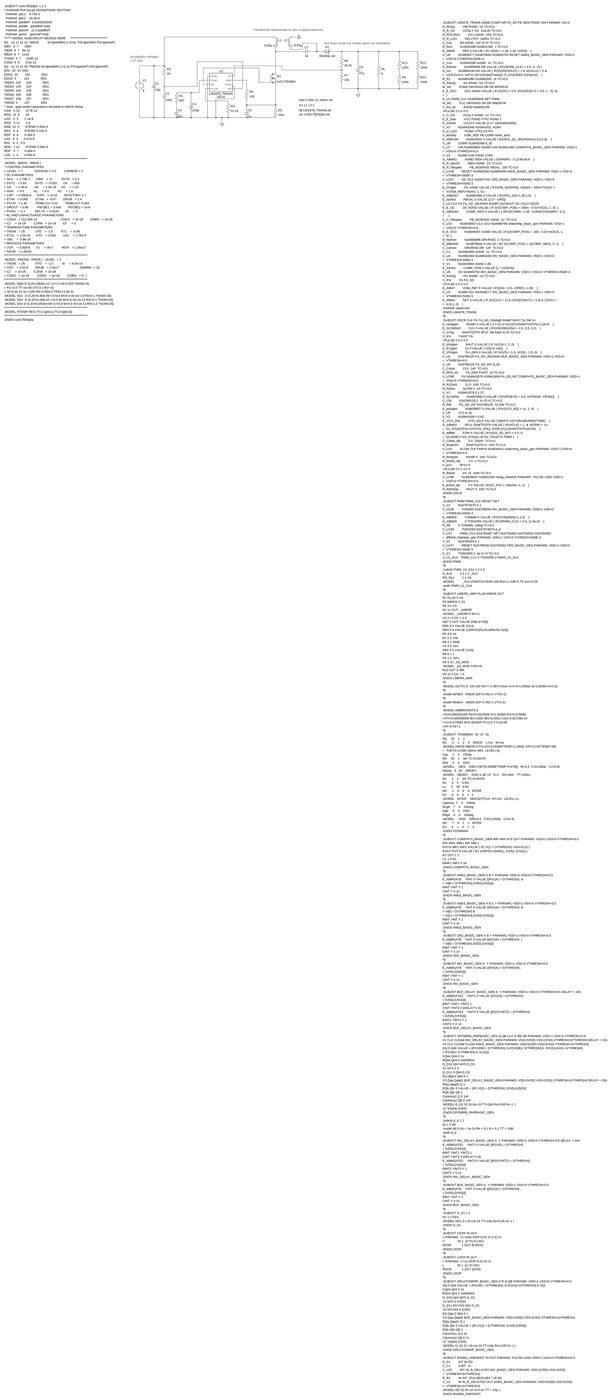
[diagram p0: schematic SolarCharge.asc, whole sheet]
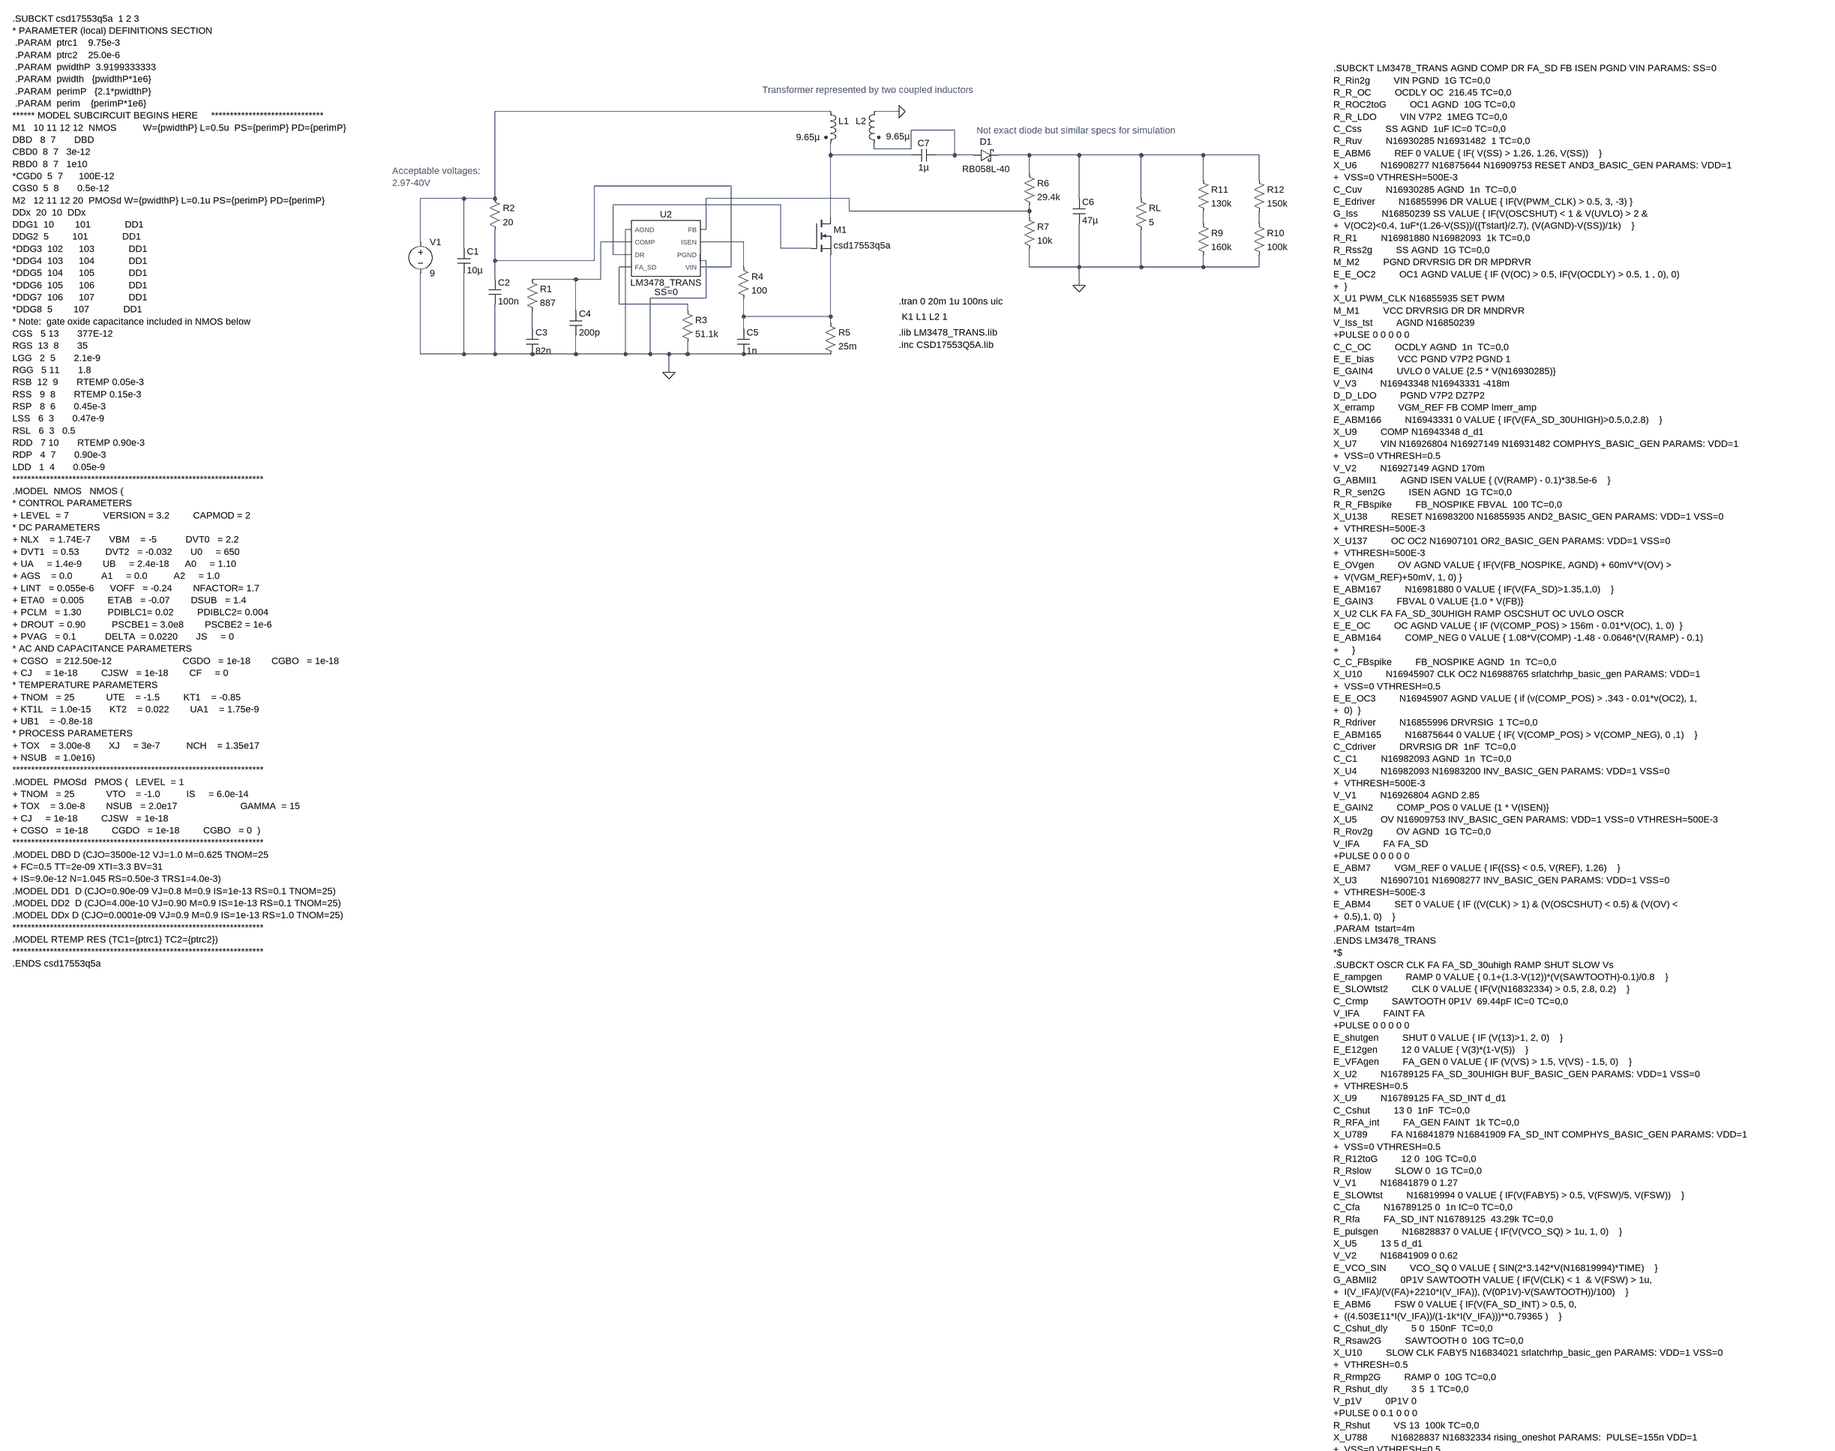
[diagram p1: schematic SolarCharge.asc, part, row 1 of 3, column 1 of 1]
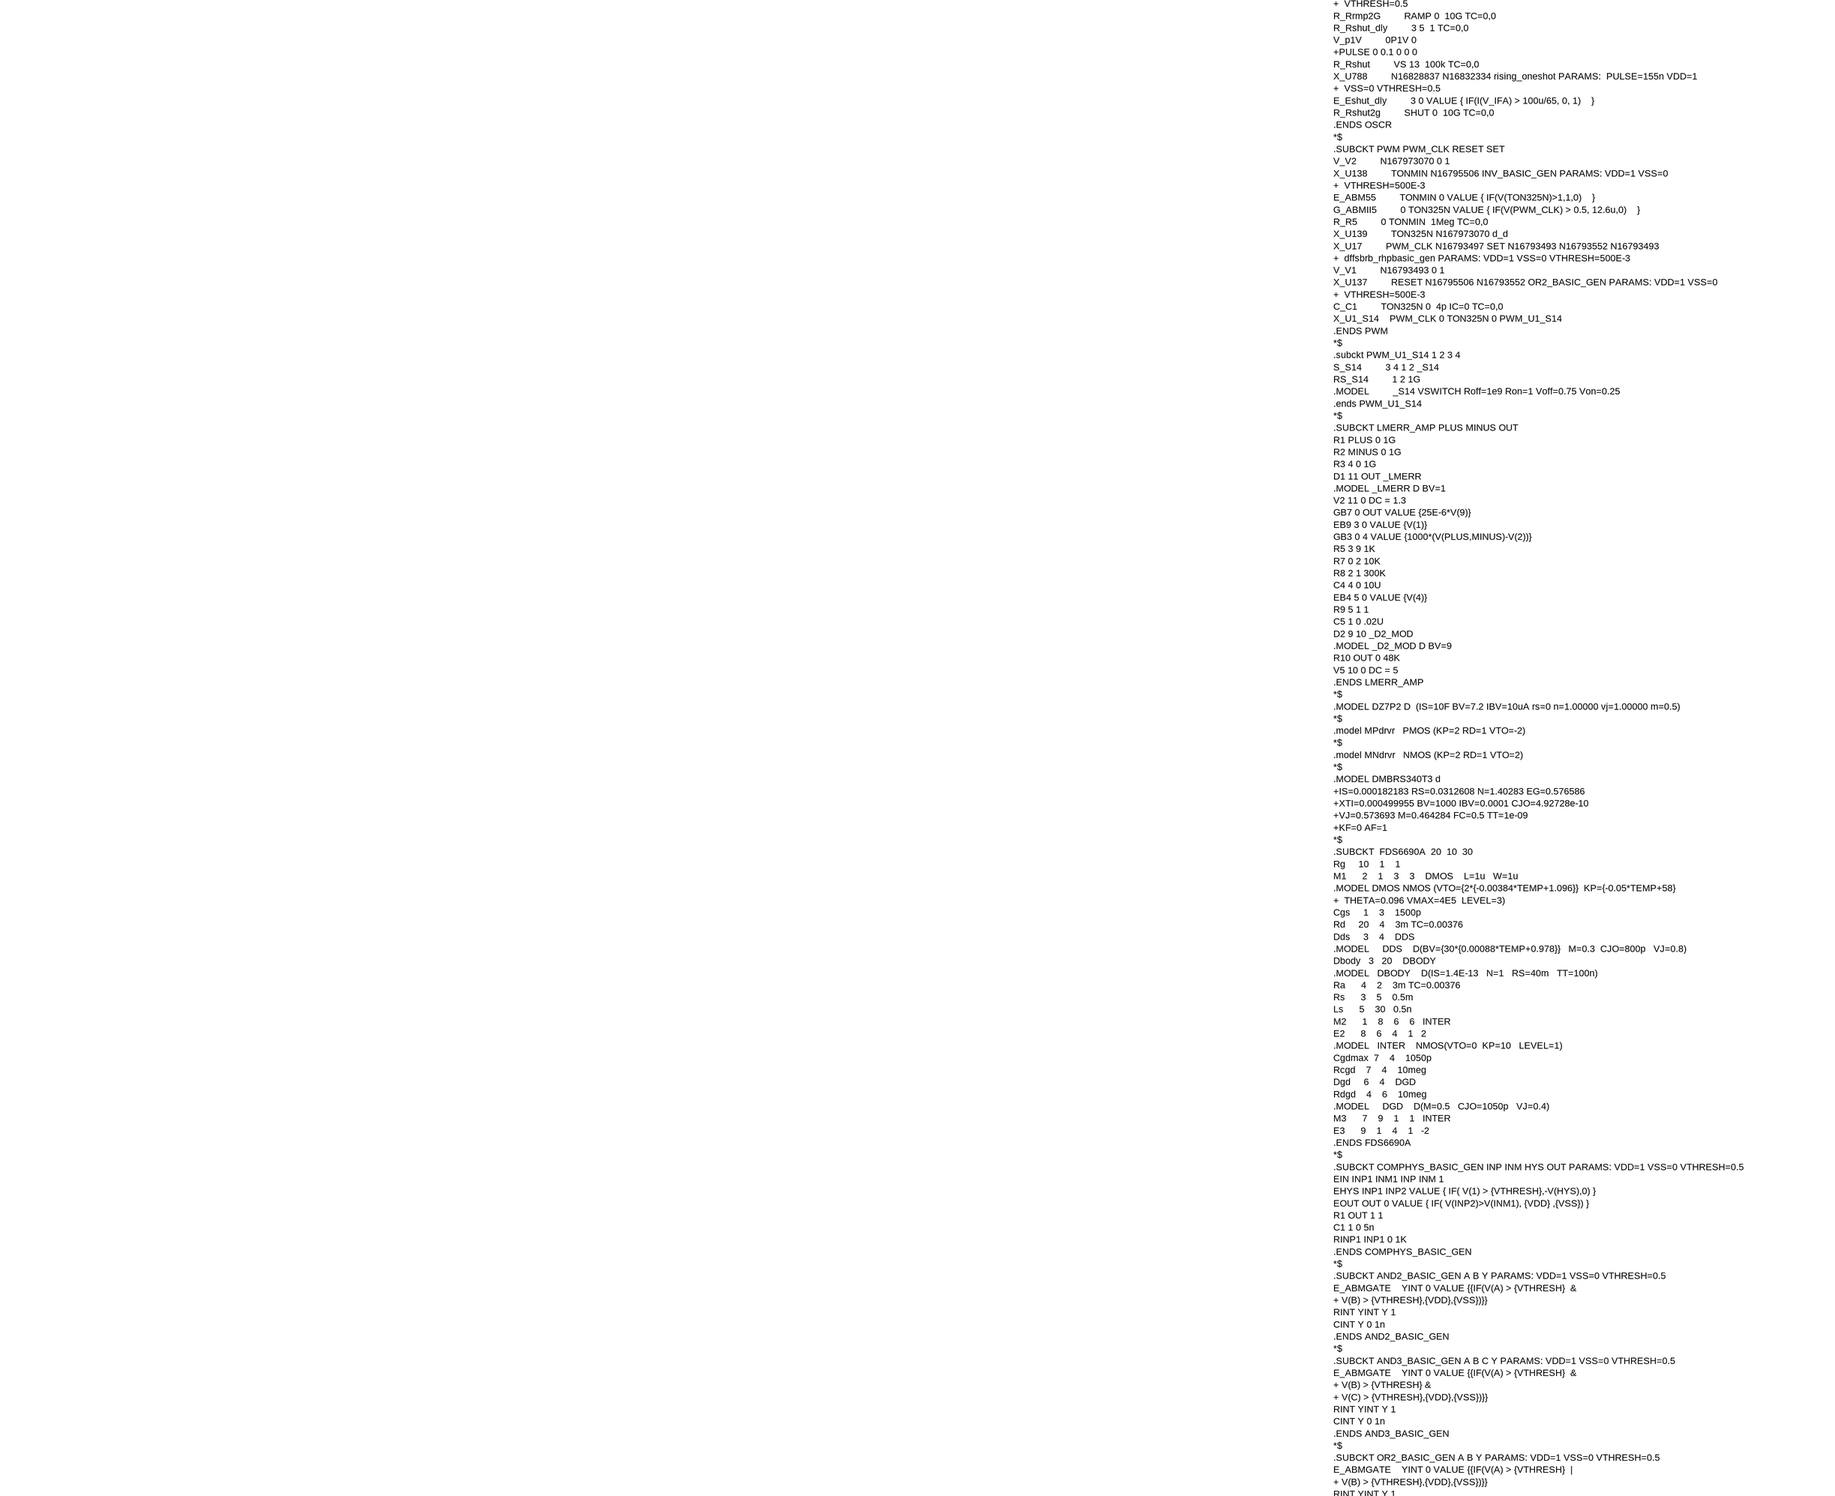
[diagram p2: schematic SolarCharge.asc, part, row 2 of 3, column 1 of 1]
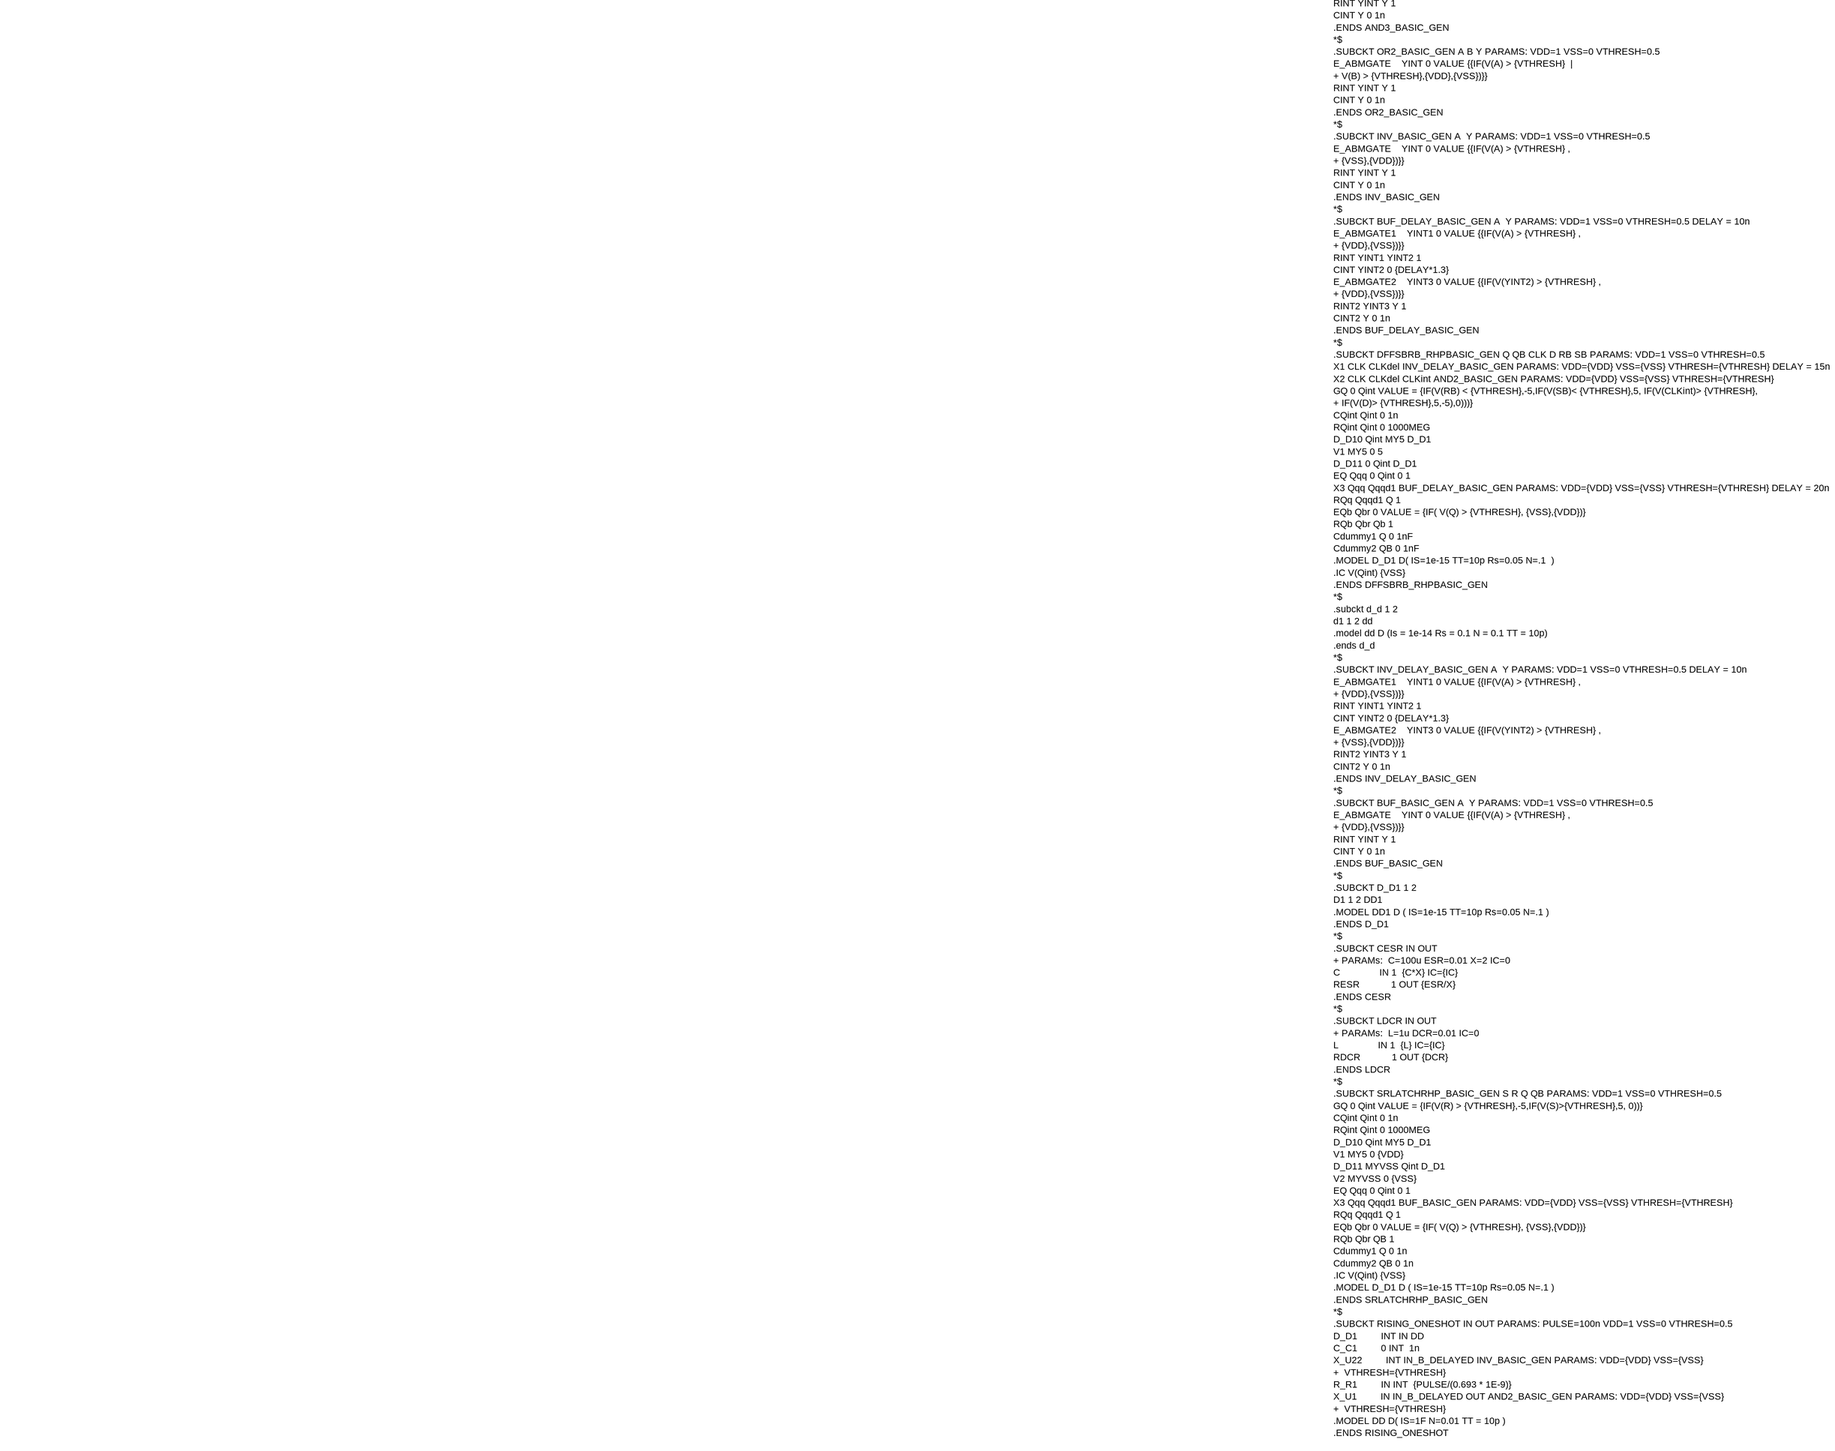
[diagram p3: schematic SolarCharge.asc, part, row 3 of 3, column 1 of 1]
SolarCharge.asc, the LTspice schematic file:
Version 4
SHEET 1 3908 10964
WIRE 1120 -176 256 -176
WIRE 1296 -176 1232 -176
WIRE 1440 -128 1328 -128
WIRE 1232 -80 1232 -96
WIRE 1328 -80 1328 -128
WIRE 1328 -80 1232 -80
WIRE 1120 -64 1120 -96
WIRE 1328 -64 1120 -64
WIRE 1440 -64 1440 -128
WIRE 1440 -64 1392 -64
WIRE 1488 -64 1440 -64
WIRE 1632 -64 1552 -64
WIRE 1760 -64 1632 -64
WIRE 1920 -64 1760 -64
WIRE 2080 -64 1920 -64
WIRE 2224 -64 2080 -64
WIRE 1632 -16 1632 -64
WIRE 2080 0 2080 -64
WIRE 2224 0 2224 -64
WIRE 864 16 512 16
WIRE 176 48 64 48
WIRE 256 48 256 -176
WIRE 256 48 176 48
WIRE 1168 48 800 48
WIRE 1760 48 1760 -64
WIRE 1920 48 1920 -64
WIRE 992 64 560 64
WIRE 1168 80 1168 48
WIRE 1632 80 1632 64
WIRE 1632 80 1168 80
WIRE 1120 96 1120 -64
WIRE 1632 96 1632 80
WIRE 2080 112 2080 80
WIRE 2224 112 2224 80
WIRE 608 128 592 128
WIRE 800 128 800 48
WIRE 800 128 784 128
WIRE 64 160 64 48
WIRE 608 160 528 160
WIRE 896 160 784 160
WIRE 176 176 176 48
WIRE 992 176 992 64
WIRE 1072 176 992 176
WIRE 560 192 560 64
WIRE 608 192 560 192
WIRE 256 208 256 128
WIRE 512 208 512 16
WIRE 512 208 256 208
WIRE 784 208 784 192
WIRE 800 208 784 208
WIRE 608 224 576 224
WIRE 864 224 864 16
WIRE 864 224 784 224
WIRE 896 224 896 160
WIRE 1632 224 1632 176
WIRE 1760 224 1760 112
WIRE 1760 224 1632 224
WIRE 1920 224 1920 128
WIRE 1920 224 1760 224
WIRE 2080 224 2080 192
WIRE 2080 224 1920 224
WIRE 2224 224 2224 192
WIRE 2224 224 2080 224
WIRE 256 256 256 208
WIRE 464 256 352 256
WIRE 528 256 528 160
WIRE 528 256 464 256
WIRE 1760 272 1760 224
WIRE 800 304 800 208
WIRE 800 304 656 304
WIRE 576 320 576 224
WIRE 752 320 576 320
WIRE 464 336 464 256
WIRE 752 336 752 320
WIRE 896 352 896 304
WIRE 1120 352 1120 192
WIRE 1120 352 896 352
WIRE 1120 368 1120 352
WIRE 352 384 352 336
WIRE 896 384 896 352
WIRE 64 448 64 240
WIRE 176 448 176 240
WIRE 176 448 64 448
WIRE 256 448 256 320
WIRE 256 448 176 448
WIRE 352 448 256 448
WIRE 464 448 464 400
WIRE 464 448 352 448
WIRE 592 448 592 128
WIRE 592 448 464 448
WIRE 656 448 656 304
WIRE 656 448 592 448
WIRE 704 448 656 448
WIRE 752 448 752 416
WIRE 752 448 704 448
WIRE 896 448 752 448
WIRE 1120 448 896 448
WIRE 704 496 704 448
FLAG 1296 -176 0
FLAG 704 496 0
FLAG 1760 272 0
SYMBOL voltage 64 144 R0
WINDOW 123 0 0 Left 0
WINDOW 39 0 0 Left 0
SYMATTR InstName V1
SYMATTR Value 9
SYMBOL cap 160 176 R0
SYMATTR InstName C1
SYMATTR Value 10µ
SYMATTR SpiceLine V=16
SYMBOL cap 336 384 R0
SYMATTR InstName C3
SYMATTR Value 82n
SYMBOL res 336 240 R0
SYMATTR InstName R1
SYMATTR Value 887
SYMBOL res 240 32 R0
SYMATTR InstName R2
SYMATTR Value 20
SYMBOL cap 448 336 R0
SYMATTR InstName C4
SYMATTR Value 200p
SYMBOL res 736 320 R0
SYMATTR InstName R3
SYMATTR Value 51.1k
SYMBOL res 880 208 R0
SYMATTR InstName R4
SYMATTR Value 100
SYMBOL cap 880 384 R0
SYMATTR InstName C5
SYMATTR Value 1n
SYMBOL nmos 1072 96 R0
SYMATTR InstName M1
SYMATTR Value csd17553q5a
SYMATTR Prefix X
SYMBOL res 1104 352 R0
SYMATTR InstName R5
SYMATTR Value 25m
SYMBOL ind2 1104 -192 R0
WINDOW 3 -73 81 Left 2
SYMATTR Value 9.65µ
SYMATTR InstName L1
SYMBOL cap 1392 -80 R90
WINDOW 0 0 32 VBottom 2
WINDOW 3 32 32 VTop 2
SYMATTR InstName C7
SYMATTR Value 1µ
SYMBOL ind2 1248 -192 M0
WINDOW 3 -76 79 Left 2
SYMATTR Value 9.65µ
SYMATTR InstName L2
SYMBOL schottky 1488 -48 R270
WINDOW 0 36 32 VTop 2
WINDOW 3 -4 32 VBottom 2
SYMATTR InstName D1
SYMATTR Value RB058L-40
SYMATTR Description Zener Diode
SYMATTR Type zener
SYMBOL res 1616 -32 R0
SYMATTR InstName R6
SYMATTR Value 29.4k
SYMBOL res 1616 80 R0
SYMATTR InstName R7
SYMATTR Value 10k
SYMBOL cap 1744 48 R0
SYMATTR InstName C6
SYMATTR Value 47µ
SYMBOL res 1904 32 R0
SYMATTR InstName RL
SYMATTR Value 5
SYMBOL cap 240 256 R0
SYMATTR InstName C2
SYMATTR Value 100n
SYMBOL LM3478_TRANS 688 176 R0
SYMATTR InstName U2
SYMBOL res 2064 96 R0
SYMATTR InstName R9
SYMATTR Value 160k
SYMBOL res 2208 96 R0
SYMATTR InstName R10
SYMATTR Value 100k
SYMBOL res 2064 -16 R0
SYMATTR InstName R11
SYMATTR Value 130k
SYMBOL res 2208 -16 R0
SYMATTR InstName R12
SYMATTR Value 150k
TEXT 1304 352 Left 2 !K1 L1 L2 1
TEXT 1296 312 Left 2 !.tran 0 20m 1u 100ns uic
TEXT 2600 -288 Left 2 !.SUBCKT LM3478_TRANS AGND COMP DR FA_SD FB ISEN PGND VIN PARAMS: SS=0\nR_Rin2g         VIN PGND  1G TC=0,0\nR_R_OC         OCDLY OC  216.45 TC=0,0\nR_ROC2toG         OC1 AGND  10G TC=0,0\nR_R_LDO         VIN V7P2  1MEG TC=0,0\nC_Css         SS AGND  1uF IC=0 TC=0,0\nR_Ruv         N16930285 N16931482  1 TC=0,0\nE_ABM6         REF 0 VALUE { IF( V(SS) > 1.26, 1.26, V(SS))    }\nX_U6         N16908277 N16875644 N16909753 RESET AND3_BASIC_GEN PARAMS: VDD=1\n+  VSS=0 VTHRESH=500E-3\nC_Cuv         N16930285 AGND  1n  TC=0,0\nE_Edriver         N16855996 DR VALUE { IF(V(PWM_CLK) > 0.5, 3, -3) }\nG_Iss         N16850239 SS VALUE { IF(V(OSCSHUT) < 1 & V(UVLO) > 2 &\n+  V(OC2)<0.4, 1uF*(1.26-V(SS))/({Tstart}/2.7), (V(AGND)-V(SS))/1k)    }\nR_R1         N16981880 N16982093  1k TC=0,0\nR_Rss2g         SS AGND  1G TC=0,0\nM_M2         PGND DRVRSIG DR DR MPDRVR\nE_E_OC2         OC1 AGND VALUE { IF (V(OC) > 0.5, IF(V(OCDLY) > 0.5, 1 , 0), 0)\n+  }\nX_U1 PWM_CLK N16855935 SET PWM\nM_M1         VCC DRVRSIG DR DR MNDRVR\nV_Iss_tst         AGND N16850239\n+PULSE 0 0 0 0 0\nC_C_OC         OCDLY AGND  1n  TC=0,0\nE_E_bias         VCC PGND V7P2 PGND 1\nE_GAIN4         UVLO 0 VALUE {2.5 * V(N16930285)}\nV_V3         N16943348 N16943331 -418m\nD_D_LDO         PGND V7P2 DZ7P2\nX_erramp         VGM_REF FB COMP lmerr_amp\nE_ABM166         N16943331 0 VALUE { IF(V(FA_SD_30UHIGH)>0.5,0,2.8)    }\nX_U9         COMP N16943348 d_d1\nX_U7         VIN N16926804 N16927149 N16931482 COMPHYS_BASIC_GEN PARAMS: VDD=1\n+  VSS=0 VTHRESH=0.5\nV_V2         N16927149 AGND 170m\nG_ABMII1         AGND ISEN VALUE { (V(RAMP) - 0.1)*38.5e-6    }\nR_R_sen2G         ISEN AGND  1G TC=0,0\nR_R_FBspike         FB_NOSPIKE FBVAL  100 TC=0,0\nX_U138         RESET N16983200 N16855935 AND2_BASIC_GEN PARAMS: VDD=1 VSS=0\n+  VTHRESH=500E-3\nX_U137         OC OC2 N16907101 OR2_BASIC_GEN PARAMS: VDD=1 VSS=0\n+  VTHRESH=500E-3\nE_OVgen         OV AGND VALUE { IF(V(FB_NOSPIKE, AGND) + 60mV*V(OV) >\n+  V(VGM_REF)+50mV, 1, 0) }\nE_ABM167         N16981880 0 VALUE { IF(V(FA_SD)>1.35,1,0)    }\nE_GAIN3         FBVAL 0 VALUE {1.0 * V(FB)}\nX_U2 CLK FA FA_SD_30UHIGH RAMP OSCSHUT OC UVLO OSCR\nE_E_OC         OC AGND VALUE { IF (V(COMP_POS) > 156m - 0.01*V(OC), 1, 0)  }\nE_ABM164         COMP_NEG 0 VALUE { 1.08*V(COMP) -1.48 - 0.0646*(V(RAMP) - 0.1)\n+     }\nC_C_FBspike         FB_NOSPIKE AGND  1n  TC=0,0\nX_U10         N16945907 CLK OC2 N16988765 srlatchrhp_basic_gen PARAMS: VDD=1\n+  VSS=0 VTHRESH=0.5\nE_E_OC3         N16945907 AGND VALUE { if (v(COMP_POS) > .343 - 0.01*v(OC2), 1,\n+  0)  }\nR_Rdriver         N16855996 DRVRSIG  1 TC=0,0\nE_ABM165         N16875644 0 VALUE { IF( V(COMP_POS) > V(COMP_NEG), 0 ,1)    }\nC_Cdriver         DRVRSIG DR  1nF  TC=0,0\nC_C1         N16982093 AGND  1n  TC=0,0\nX_U4         N16982093 N16983200 INV_BASIC_GEN PARAMS: VDD=1 VSS=0\n+  VTHRESH=500E-3\nV_V1         N16926804 AGND 2.85\nE_GAIN2         COMP_POS 0 VALUE {1 * V(ISEN)}\nX_U5         OV N16909753 INV_BASIC_GEN PARAMS: VDD=1 VSS=0 VTHRESH=500E-3\nR_Rov2g         OV AGND  1G TC=0,0\nV_IFA         FA FA_SD\n+PULSE 0 0 0 0 0\nE_ABM7         VGM_REF 0 VALUE { IF({SS} < 0.5, V(REF), 1.26)    }\nX_U3         N16907101 N16908277 INV_BASIC_GEN PARAMS: VDD=1 VSS=0\n+  VTHRESH=500E-3\nE_ABM4         SET 0 VALUE { IF ((V(CLK) > 1) & (V(OSCSHUT) < 0.5) & (V(OV) <\n+  0.5),1, 0)    }\n.PARAM  tstart=4m\n.ENDS LM3478_TRANS\n*$\n.SUBCKT OSCR CLK FA FA_SD_30uhigh RAMP SHUT SLOW Vs\nE_rampgen         RAMP 0 VALUE { 0.1+(1.3-V(12))*(V(SAWTOOTH)-0.1)/0.8    }\nE_SLOWtst2         CLK 0 VALUE { IF(V(N16832334) > 0.5, 2.8, 0.2)    }\nC_Crmp         SAWTOOTH 0P1V  69.44pF IC=0 TC=0,0\nV_IFA         FAINT FA\n+PULSE 0 0 0 0 0\nE_shutgen         SHUT 0 VALUE { IF (V(13)>1, 2, 0)    }\nE_E12gen         12 0 VALUE { V(3)*(1-V(5))    }\nE_VFAgen         FA_GEN 0 VALUE { IF (V(VS) > 1.5, V(VS) - 1.5, 0)    }\nX_U2         N16789125 FA_SD_30UHIGH BUF_BASIC_GEN PARAMS: VDD=1 VSS=0\n+  VTHRESH=0.5\nX_U9         N16789125 FA_SD_INT d_d1\nC_Cshut         13 0  1nF  TC=0,0\nR_RFA_int         FA_GEN FAINT  1k TC=0,0\nX_U789         FA N16841879 N16841909 FA_SD_INT COMPHYS_BASIC_GEN PARAMS: VDD=1\n+  VSS=0 VTHRESH=0.5\nR_R12toG         12 0  10G TC=0,0\nR_Rslow         SLOW 0  1G TC=0,0\nV_V1         N16841879 0 1.27\nE_SLOWtst         N16819994 0 VALUE { IF(V(FABY5) > 0.5, V(FSW)/5, V(FSW))    }\nC_Cfa         N16789125 0  1n IC=0 TC=0,0\nR_Rfa         FA_SD_INT N16789125  43.29k TC=0,0\nE_pulsgen         N16828837 0 VALUE { IF(V(VCO_SQ) > 1u, 1, 0)    }\nX_U5         13 5 d_d1\nV_V2         N16841909 0 0.62\nE_VCO_SIN         VCO_SQ 0 VALUE { SIN(2*3.142*V(N16819994)*TIME)    }\nG_ABMII2         0P1V SAWTOOTH VALUE { IF(V(CLK) < 1  & V(FSW) > 1u,\n+  I(V_IFA)/(V(FA)+2210*I(V_IFA)), (V(0P1V)-V(SAWTOOTH))/100)    }\nE_ABM6         FSW 0 VALUE { IF(V(FA_SD_INT) > 0.5, 0,\n+  ((4.503E11*I(V_IFA))/(1-1k*I(V_IFA)))**0.79365 )    }\nC_Cshut_dly         5 0  150nF  TC=0,0\nR_Rsaw2G         SAWTOOTH 0  10G TC=0,0\nX_U10         SLOW CLK FABY5 N16834021 srlatchrhp_basic_gen PARAMS: VDD=1 VSS=0\n+  VTHRESH=0.5\nR_Rrmp2G         RAMP 0  10G TC=0,0\nR_Rshut_dly         3 5  1 TC=0,0\nV_p1V         0P1V 0\n+PULSE 0 0.1 0 0 0\nR_Rshut         VS 13  100k TC=0,0\nX_U788         N16828837 N16832334 rising_oneshot PARAMS:  PULSE=155n VDD=1\n+  VSS=0 VTHRESH=0.5\nE_Eshut_dly         3 0 VALUE { IF(I(V_IFA) > 100u/65, 0, 1)    }\nR_Rshut2g         SHUT 0  10G TC=0,0\n.ENDS OSCR\n*$\n.SUBCKT PWM PWM_CLK RESET SET\nV_V2         N167973070 0 1\nX_U138         TONMIN N16795506 INV_BASIC_GEN PARAMS: VDD=1 VSS=0\n+  VTHRESH=500E-3\nE_ABM55         TONMIN 0 VALUE { IF(V(TON325N)>1,1,0)    }\nG_ABMII5         0 TON325N VALUE { IF(V(PWM_CLK) > 0.5, 12.6u,0)    }\nR_R5         0 TONMIN  1Meg TC=0,0\nX_U139         TON325N N167973070 d_d\nX_U17         PWM_CLK N16793497 SET N16793493 N16793552 N16793493\n+  dffsbrb_rhpbasic_gen PARAMS: VDD=1 VSS=0 VTHRESH=500E-3\nV_V1         N16793493 0 1\nX_U137         RESET N16795506 N16793552 OR2_BASIC_GEN PARAMS: VDD=1 VSS=0\n+  VTHRESH=500E-3\nC_C1         TON325N 0  4p IC=0 TC=0,0\nX_U1_S14    PWM_CLK 0 TON325N 0 PWM_U1_S14\n.ENDS PWM\n*$\n.subckt PWM_U1_S14 1 2 3 4\nS_S14         3 4 1 2 _S14\nRS_S14         1 2 1G\n.MODEL         _S14 VSWITCH Roff=1e9 Ron=1 Voff=0.75 Von=0.25\n.ends PWM_U1_S14\n*$\n.SUBCKT LMERR_AMP PLUS MINUS OUT\nR1 PLUS 0 1G\nR2 MINUS 0 1G\nR3 4 0 1G\nD1 11 OUT _LMERR\n.MODEL _LMERR D BV=1\nV2 11 0 DC = 1.3\nGB7 0 OUT VALUE {25E-6*V(9)}\nEB9 3 0 VALUE {V(1)}\nGB3 0 4 VALUE {1000*(V(PLUS,MINUS)-V(2))}\nR5 3 9 1K\nR7 0 2 10K\nR8 2 1 300K\nC4 4 0 10U\nEB4 5 0 VALUE {V(4)}\nR9 5 1 1\nC5 1 0 .02U\nD2 9 10 _D2_MOD\n.MODEL _D2_MOD D BV=9\nR10 OUT 0 48K\nV5 10 0 DC = 5\n.ENDS LMERR_AMP\n*$\n.MODEL DZ7P2 D  (IS=10F BV=7.2 IBV=10uA rs=0 n=1.00000 vj=1.00000 m=0.5)\n*$\n.model MPdrvr   PMOS (KP=2 RD=1 VTO=-2)\n*$\n.model MNdrvr   NMOS (KP=2 RD=1 VTO=2)\n*$\n.MODEL DMBRS340T3 d\n+IS=0.000182183 RS=0.0312608 N=1.40283 EG=0.576586\n+XTI=0.000499955 BV=1000 IBV=0.0001 CJO=4.92728e-10\n+VJ=0.573693 M=0.464284 FC=0.5 TT=1e-09\n+KF=0 AF=1\n*$\n.SUBCKT  FDS6690A  20  10  30\nRg     10    1    1\nM1      2    1    3    3    DMOS    L=1u   W=1u\n.MODEL DMOS NMOS (VTO={2*{-0.00384*TEMP+1.096}}  KP={-0.05*TEMP+58}\n+  THETA=0.096 VMAX=4E5  LEVEL=3)\nCgs     1    3    1500p\nRd     20    4    3m TC=0.00376\nDds     3    4    DDS\n.MODEL     DDS    D(BV={30*{0.00088*TEMP+0.978}}   M=0.3  CJO=800p   VJ=0.8)\nDbody   3   20    DBODY\n.MODEL   DBODY    D(IS=1.4E-13   N=1   RS=40m   TT=100n)\nRa      4    2    3m TC=0.00376\nRs      3    5    0.5m\nLs      5    30   0.5n\nM2      1    8    6    6   INTER\nE2      8    6    4    1   2\n.MODEL   INTER    NMOS(VTO=0  KP=10   LEVEL=1)\nCgdmax  7    4    1050p\nRcgd    7    4    10meg\nDgd     6    4    DGD\nRdgd    4    6    10meg\n.MODEL     DGD    D(M=0.5   CJO=1050p   VJ=0.4)\nM3      7    9    1    1   INTER\nE3      9    1    4    1   -2\n.ENDS FDS6690A\n*$\n.SUBCKT COMPHYS_BASIC_GEN INP INM HYS OUT PARAMS: VDD=1 VSS=0 VTHRESH=0.5\nEIN INP1 INM1 INP INM 1\nEHYS INP1 INP2 VALUE { IF( V(1) > {VTHRESH},-V(HYS),0) }\nEOUT OUT 0 VALUE { IF( V(INP2)>V(INM1), {VDD} ,{VSS}) }\nR1 OUT 1 1\nC1 1 0 5n\nRINP1 INP1 0 1K\n.ENDS COMPHYS_BASIC_GEN\n*$\n.SUBCKT AND2_BASIC_GEN A B Y PARAMS: VDD=1 VSS=0 VTHRESH=0.5\nE_ABMGATE    YINT 0 VALUE {{IF(V(A) > {VTHRESH}  &\n+ V(B) > {VTHRESH},{VDD},{VSS})}}\nRINT YINT Y 1\nCINT Y 0 1n\n.ENDS AND2_BASIC_GEN\n*$\n.SUBCKT AND3_BASIC_GEN A B C Y PARAMS: VDD=1 VSS=0 VTHRESH=0.5\nE_ABMGATE    YINT 0 VALUE {{IF(V(A) > {VTHRESH}  &\n+ V(B) > {VTHRESH} &\n+ V(C) > {VTHRESH},{VDD},{VSS})}}\nRINT YINT Y 1\nCINT Y 0 1n\n.ENDS AND3_BASIC_GEN\n*$\n.SUBCKT OR2_BASIC_GEN A B Y PARAMS: VDD=1 VSS=0 VTHRESH=0.5\nE_ABMGATE    YINT 0 VALUE {{IF(V(A) > {VTHRESH}  |\n+ V(B) > {VTHRESH},{VDD},{VSS})}}\nRINT YINT Y 1\nCINT Y 0 1n\n.ENDS OR2_BASIC_GEN\n*$\n.SUBCKT INV_BASIC_GEN A  Y PARAMS: VDD=1 VSS=0 VTHRESH=0.5\nE_ABMGATE    YINT 0 VALUE {{IF(V(A) > {VTHRESH} ,\n+ {VSS},{VDD})}}\nRINT YINT Y 1\nCINT Y 0 1n\n.ENDS INV_BASIC_GEN\n*$\n.SUBCKT BUF_DELAY_BASIC_GEN A  Y PARAMS: VDD=1 VSS=0 VTHRESH=0.5 DELAY = 10n\nE_ABMGATE1    YINT1 0 VALUE {{IF(V(A) > {VTHRESH} ,\n+ {VDD},{VSS})}}\nRINT YINT1 YINT2 1\nCINT YINT2 0 {DELAY*1.3}\nE_ABMGATE2    YINT3 0 VALUE {{IF(V(YINT2) > {VTHRESH} ,\n+ {VDD},{VSS})}}\nRINT2 YINT3 Y 1\nCINT2 Y 0 1n\n.ENDS BUF_DELAY_BASIC_GEN\n*$\n.SUBCKT DFFSBRB_RHPBASIC_GEN Q QB CLK D RB SB PARAMS: VDD=1 VSS=0 VTHRESH=0.5\nX1 CLK CLKdel INV_DELAY_BASIC_GEN PARAMS: VDD={VDD} VSS={VSS} VTHRESH={VTHRESH} DELAY = 15n\nX2 CLK CLKdel CLKint AND2_BASIC_GEN PARAMS: VDD={VDD} VSS={VSS} VTHRESH={VTHRESH}\nGQ 0 Qint VALUE = {IF(V(RB) < {VTHRESH},-5,IF(V(SB)< {VTHRESH},5, IF(V(CLKint)> {VTHRESH},\n+ IF(V(D)> {VTHRESH},5,-5),0)))}\nCQint Qint 0 1n\nRQint Qint 0 1000MEG\nD_D10 Qint MY5 D_D1\nV1 MY5 0 5\nD_D11 0 Qint D_D1\nEQ Qqq 0 Qint 0 1\nX3 Qqq Qqqd1 BUF_DELAY_BASIC_GEN PARAMS: VDD={VDD} VSS={VSS} VTHRESH={VTHRESH} DELAY = 20n\nRQq Qqqd1 Q 1\nEQb Qbr 0 VALUE = {IF( V(Q) > {VTHRESH}, {VSS},{VDD})}\nRQb Qbr Qb 1\nCdummy1 Q 0 1nF\nCdummy2 QB 0 1nF\n.MODEL D_D1 D( IS=1e-15 TT=10p Rs=0.05 N=.1  )\n.IC V(Qint) {VSS}\n.ENDS DFFSBRB_RHPBASIC_GEN\n*$\n.subckt d_d 1 2\nd1 1 2 dd\n.model dd D (Is = 1e-14 Rs = 0.1 N = 0.1 TT = 10p)\n.ends d_d\n*$\n.SUBCKT INV_DELAY_BASIC_GEN A  Y PARAMS: VDD=1 VSS=0 VTHRESH=0.5 DELAY = 10n\nE_ABMGATE1    YINT1 0 VALUE {{IF(V(A) > {VTHRESH} ,\n+ {VDD},{VSS})}}\nRINT YINT1 YINT2 1\nCINT YINT2 0 {DELAY*1.3}\nE_ABMGATE2    YINT3 0 VALUE {{IF(V(YINT2) > {VTHRESH} ,\n+ {VSS},{VDD})}}\nRINT2 YINT3 Y 1\nCINT2 Y 0 1n\n.ENDS INV_DELAY_BASIC_GEN\n*$\n.SUBCKT BUF_BASIC_GEN A  Y PARAMS: VDD=1 VSS=0 VTHRESH=0.5\nE_ABMGATE    YINT 0 VALUE {{IF(V(A) > {VTHRESH} ,\n+ {VDD},{VSS})}}\nRINT YINT Y 1\nCINT Y 0 1n\n.ENDS BUF_BASIC_GEN\n*$\n.SUBCKT D_D1 1 2\nD1 1 2 DD1\n.MODEL DD1 D ( IS=1e-15 TT=10p Rs=0.05 N=.1 )\n.ENDS D_D1\n*$\n.SUBCKT CESR IN OUT\n+ PARAMs:  C=100u ESR=0.01 X=2 IC=0\nC               IN 1  {C*X} IC={IC}\nRESR            1 OUT {ESR/X}\n.ENDS CESR\n*$\n.SUBCKT LDCR IN OUT\n+ PARAMs:  L=1u DCR=0.01 IC=0\nL               IN 1  {L} IC={IC}\nRDCR            1 OUT {DCR}\n.ENDS LDCR\n*$\n.SUBCKT SRLATCHRHP_BASIC_GEN S R Q QB PARAMS: VDD=1 VSS=0 VTHRESH=0.5\nGQ 0 Qint VALUE = {IF(V(R) > {VTHRESH},-5,IF(V(S)>{VTHRESH},5, 0))}\nCQint Qint 0 1n\nRQint Qint 0 1000MEG\nD_D10 Qint MY5 D_D1\nV1 MY5 0 {VDD}\nD_D11 MYVSS Qint D_D1\nV2 MYVSS 0 {VSS}\nEQ Qqq 0 Qint 0 1\nX3 Qqq Qqqd1 BUF_BASIC_GEN PARAMS: VDD={VDD} VSS={VSS} VTHRESH={VTHRESH}\nRQq Qqqd1 Q 1\nEQb Qbr 0 VALUE = {IF( V(Q) > {VTHRESH}, {VSS},{VDD})}\nRQb Qbr QB 1\nCdummy1 Q 0 1n\nCdummy2 QB 0 1n\n.IC V(Qint) {VSS}\n.MODEL D_D1 D ( IS=1e-15 TT=10p Rs=0.05 N=.1 )\n.ENDS SRLATCHRHP_BASIC_GEN\n*$\n.SUBCKT RISING_ONESHOT IN OUT PARAMS: PULSE=100n VDD=1 VSS=0 VTHRESH=0.5\nD_D1         INT IN DD\nC_C1         0 INT  1n\nX_U22         INT IN_B_DELAYED INV_BASIC_GEN PARAMS: VDD={VDD} VSS={VSS}\n+  VTHRESH={VTHRESH}\nR_R1         IN INT  {PULSE/(0.693 * 1E-9)}\nX_U1         IN IN_B_DELAYED OUT AND2_BASIC_GEN PARAMS: VDD={VDD} VSS={VSS}\n+  VTHRESH={VTHRESH}\n.MODEL DD D( IS=1F N=0.01 TT = 10p )\n.ENDS RISING_ONESHOT
TEXT -1568 -416 Left 2 !.SUBCKT csd17553q5a  1 2 3\n* PARAMETER (local) DEFINITIONS SECTION\n .PARAM  ptrc1    9.75e-3  \n .PARAM  ptrc2    25.0e-6\n .PARAM  pwidthP  3.9199333333\n .PARAM  pwidth   {pwidthP*1e6}\n .PARAM  perimP   {2.1*pwidthP}\n .PARAM  perim    {perimP*1e6}\n****** MODEL SUBCIRCUIT BEGINS HERE     ******************************\nM1   10 11 12 12  NMOS          W={pwidthP} L=0.5u  PS={perimP} PD={perimP}\nDBD   8  7       DBD\nCBD0  8  7   3e-12\nRBD0  8  7   1e10\n*CGD0  5  7      100E-12\nCGS0  5  8       0.5e-12\nM2   12 11 12 20  PMOSd W={pwidthP} L=0.1u PS={perimP} PD={perimP}\nDDx  20  10  DDx\nDDG1  10        101             DD1\nDDG2  5         101             DD1\n*DDG3  102      103             DD1\n*DDG4  103      104             DD1\n*DDG5  104      105             DD1\n*DDG6  105      106             DD1\n*DDG7  106      107             DD1\n*DDG8  5        107             DD1\n* Note:  gate oxide capacitance included in NMOS below\nCGS   5 13       377E-12\nRGS  13  8       35\nLGG   2  5       2.1e-9\nRGG   5 11       1.8\nRSB  12  9       RTEMP 0.05e-3\nRSS   9  8       RTEMP 0.15e-3\nRSP   8  6       0.45e-3\nLSS   6  3       0.47e-9\nRSL   6  3   0.5\nRDD   7 10       RTEMP 0.90e-3\nRDP   4  7       0.90e-3\nLDD   1  4       0.05e-9\n******************************************************************* \n.MODEL  NMOS   NMOS (\n* CONTROL PARAMETERS\n+ LEVEL  = 7             VERSION = 3.2         CAPMOD = 2\n* DC PARAMETERS\n+ NLX    = 1.74E-7       VBM    = -5           DVT0   = 2.2\n+ DVT1   = 0.53          DVT2   = -0.032       U0     = 650\n+ UA     = 1.4e-9        UB     = 2.4e-18      A0     = 1.10\n+ AGS    = 0.0           A1     = 0.0          A2     = 1.0\n+ LINT   = 0.055e-6      VOFF   = -0.24        NFACTOR= 1.7\n+ ETA0   = 0.005         ETAB   = -0.07        DSUB   = 1.4\n+ PCLM   = 1.30          PDIBLC1= 0.02         PDIBLC2= 0.004\n+ DROUT  = 0.90          PSCBE1 = 3.0e8        PSCBE2 = 1e-6\n+ PVAG   = 0.1           DELTA  = 0.0220       JS     = 0\n* AC AND CAPACITANCE PARAMETERS\n+ CGSO   = 212.50e-12                           CGDO   = 1e-18        CGBO   = 1e-18\n+ CJ     = 1e-18         CJSW   = 1e-18        CF     = 0\n* TEMPERATURE PARAMETERS\n+ TNOM   = 25            UTE    = -1.5         KT1    = -0.85\n+ KT1L   = 1.0e-15       KT2    = 0.022        UA1    = 1.75e-9\n+ UB1    = -0.8e-18      \n* PROCESS PARAMETERS\n+ TOX    = 3.00e-8       XJ     = 3e-7          NCH    = 1.35e17\n+ NSUB   = 1.0e16)\n******************************************************************* \n.MODEL  PMOSd   PMOS (   LEVEL  = 1\n+ TNOM   = 25            VTO    = -1.0          IS     = 6.0e-14\n+ TOX    = 3.0e-8        NSUB   = 2.0e17                        GAMMA  = 15\n+ CJ     = 1e-18         CJSW   = 1e-18\n+ CGSO   = 1e-18         CGDO   = 1e-18         CGBO   = 0  )\n*******************************************************************\n.MODEL DBD D (CJO=3500e-12 VJ=1.0 M=0.625 TNOM=25\n+ FC=0.5 TT=2e-09 XTI=3.3 BV=31\n+ IS=9.0e-12 N=1.045 RS=0.50e-3 TRS1=4.0e-3)\n.MODEL DD1  D (CJO=0.90e-09 VJ=0.8 M=0.9 IS=1e-13 RS=0.1 TNOM=25)\n.MODEL DD2  D (CJO=4.00e-10 VJ=0.90 M=0.9 IS=1e-13 RS=0.1 TNOM=25)\n.MODEL DDx D (CJO=0.0001e-09 VJ=0.9 M=0.9 IS=1e-13 RS=1.0 TNOM=25)\n*******************************************************************\n.MODEL RTEMP RES (TC1={ptrc1} TC2={ptrc2})\n*******************************************************************\n.ENDS csd17553q5a
TEXT 1296 392 Left 2 !.lib LM3478_TRANS.lib
TEXT 1296 424 Left 2 !.inc CSD17553Q5A.lib
TEXT 944 -232 Left 2 ;Transformer represented by two coupled inductors
TEXT 1496 -128 Left 2 ;Not exact diode but similar specs for simulation
TEXT -8 -24 Left 2 ;Acceptable voltages:\n2.97-40V

The netlist it stands for:
* SolarCharge.asc
V1 N001 0 9
C1 N001 0 10µ V=16
C3 N014 0 82n
R1 N010 N014 887
R2 N001 N005 20
C4 N010 0 200p
R3 N012 0 51.1k
R4 N011 N013 100
C5 N013 0 1n
XM1 N003 N007 N013 csd17553q5a  ; pins D G S
R5 N013 0 25m
L1 N001 N003 9.65µ
C7 N002 N003 1µ
L2 0 N002 9.65µ
D1 N002 N004 RB058L-40
R6 N004 N006 29.4k
R7 N006 0 10k
C6 N004 0 47µ
RL N004 0 5
C2 N005 0 100n
XU2 0 N010 N007 N012 N006 N011 0 N005 LM3478_TRANS SS=0  ; pins AGND COMP DR FA_SD FB ISEN PGND VIN
R9 N008 0 160k
R10 N009 0 100k
R11 N004 N008 130k
R12 N004 N009 150k
.model D D
.lib standard.dio
K1 L1 L2 1
.tran 0 20m 1u 100ns uic
.SUBCKT LM3478_TRANS AGND COMP DR FA_SD FB ISEN PGND VIN PARAMS: SS=0
R_Rin2g         VIN PGND  1G TC=0,0
R_R_OC         OCDLY OC  216.45 TC=0,0
R_ROC2toG         OC1 AGND  10G TC=0,0
R_R_LDO         VIN V7P2  1MEG TC=0,0
C_Css         SS AGND  1uF IC=0 TC=0,0
R_Ruv         N16930285 N16931482  1 TC=0,0
E_ABM6         REF 0 VALUE { IF( V(SS) > 1.26, 1.26, V(SS))    }
X_U6         N16908277 N16875644 N16909753 RESET AND3_BASIC_GEN PARAMS: VDD=1
+  VSS=0 VTHRESH=500E-3
C_Cuv         N16930285 AGND  1n  TC=0,0
E_Edriver         N16855996 DR VALUE { IF(V(PWM_CLK) > 0.5, 3, -3) }
G_Iss         N16850239 SS VALUE { IF(V(OSCSHUT) < 1 & V(UVLO) > 2 &
+  V(OC2)<0.4, 1uF*(1.26-V(SS))/({Tstart}/2.7), (V(AGND)-V(SS))/1k)    }
R_R1         N16981880 N16982093  1k TC=0,0
R_Rss2g         SS AGND  1G TC=0,0
M_M2         PGND DRVRSIG DR DR MPDRVR
E_E_OC2         OC1 AGND VALUE { IF (V(OC) > 0.5, IF(V(OCDLY) > 0.5, 1 , 0), 0)
+  }
X_U1 PWM_CLK N16855935 SET PWM
M_M1         VCC DRVRSIG DR DR MNDRVR
V_Iss_tst         AGND N16850239
+PULSE 0 0 0 0 0
C_C_OC         OCDLY AGND  1n  TC=0,0
E_E_bias         VCC PGND V7P2 PGND 1
E_GAIN4         UVLO 0 VALUE {2.5 * V(N16930285)}
V_V3         N16943348 N16943331 -418m
D_D_LDO         PGND V7P2 DZ7P2
X_erramp         VGM_REF FB COMP lmerr_amp
E_ABM166         N16943331 0 VALUE { IF(V(FA_SD_30UHIGH)>0.5,0,2.8)    }
X_U9         COMP N16943348 d_d1
X_U7         VIN N16926804 N16927149 N16931482 COMPHYS_BASIC_GEN PARAMS: VDD=1
+  VSS=0 VTHRESH=0.5
V_V2         N16927149 AGND 170m
G_ABMII1         AGND ISEN VALUE { (V(RAMP) - 0.1)*38.5e-6    }
R_R_sen2G         ISEN AGND  1G TC=0,0
R_R_FBspike         FB_NOSPIKE FBVAL  100 TC=0,0
X_U138         RESET N16983200 N16855935 AND2_BASIC_GEN PARAMS: VDD=1 VSS=0
+  VTHRESH=500E-3
X_U137         OC OC2 N16907101 OR2_BASIC_GEN PARAMS: VDD=1 VSS=0
+  VTHRESH=500E-3
E_OVgen         OV AGND VALUE { IF(V(FB_NOSPIKE, AGND) + 60mV*V(OV) >
+  V(VGM_REF)+50mV, 1, 0) }
E_ABM167         N16981880 0 VALUE { IF(V(FA_SD)>1.35,1,0)    }
E_GAIN3         FBVAL 0 VALUE {1.0 * V(FB)}
X_U2 CLK FA FA_SD_30UHIGH RAMP OSCSHUT OC UVLO OSCR
E_E_OC         OC AGND VALUE { IF (V(COMP_POS) > 156m - 0.01*V(OC), 1, 0)  }
E_ABM164         COMP_NEG 0 VALUE { 1.08*V(COMP) -1.48 - 0.0646*(V(RAMP) - 0.1)
+     }
C_C_FBspike         FB_NOSPIKE AGND  1n  TC=0,0
X_U10         N16945907 CLK OC2 N16988765 srlatchrhp_basic_gen PARAMS: VDD=1
+  VSS=0 VTHRESH=0.5
E_E_OC3         N16945907 AGND VALUE { if (v(COMP_POS) > .343 - 0.01*v(OC2), 1,
+  0)  }
R_Rdriver         N16855996 DRVRSIG  1 TC=0,0
E_ABM165         N16875644 0 VALUE { IF( V(COMP_POS) > V(COMP_NEG), 0 ,1)    }
C_Cdriver         DRVRSIG DR  1nF  TC=0,0
C_C1         N16982093 AGND  1n  TC=0,0
X_U4         N16982093 N16983200 INV_BASIC_GEN PARAMS: VDD=1 VSS=0
+  VTHRESH=500E-3
V_V1         N16926804 AGND 2.85
E_GAIN2         COMP_POS 0 VALUE {1 * V(ISEN)}
X_U5         OV N16909753 INV_BASIC_GEN PARAMS: VDD=1 VSS=0 VTHRESH=500E-3
R_Rov2g         OV AGND  1G TC=0,0
V_IFA         FA FA_SD
+PULSE 0 0 0 0 0
E_ABM7         VGM_REF 0 VALUE { IF({SS} < 0.5, V(REF), 1.26)    }
X_U3         N16907101 N16908277 INV_BASIC_GEN PARAMS: VDD=1 VSS=0
+  VTHRESH=500E-3
E_ABM4         SET 0 VALUE { IF ((V(CLK) > 1) & (V(OSCSHUT) < 0.5) & (V(OV) <
+  0.5),1, 0)    }
.PARAM  tstart=4m
.ENDS LM3478_TRANS
*$
.SUBCKT OSCR CLK FA FA_SD_30uhigh RAMP SHUT SLOW Vs
E_rampgen         RAMP 0 VALUE { 0.1+(1.3-V(12))*(V(SAWTOOTH)-0.1)/0.8    }
E_SLOWtst2         CLK 0 VALUE { IF(V(N16832334) > 0.5, 2.8, 0.2)    }
C_Crmp         SAWTOOTH 0P1V  69.44pF IC=0 TC=0,0
V_IFA         FAINT FA
+PULSE 0 0 0 0 0
E_shutgen         SHUT 0 VALUE { IF (V(13)>1, 2, 0)    }
E_E12gen         12 0 VALUE { V(3)*(1-V(5))    }
E_VFAgen         FA_GEN 0 VALUE { IF (V(VS) > 1.5, V(VS) - 1.5, 0)    }
X_U2         N16789125 FA_SD_30UHIGH BUF_BASIC_GEN PARAMS: VDD=1 VSS=0
+  VTHRESH=0.5
X_U9         N16789125 FA_SD_INT d_d1
C_Cshut         13 0  1nF  TC=0,0
R_RFA_int         FA_GEN FAINT  1k TC=0,0
X_U789         FA N16841879 N16841909 FA_SD_INT COMPHYS_BASIC_GEN PARAMS: VDD=1
+  VSS=0 VTHRESH=0.5
R_R12toG         12 0  10G TC=0,0
R_Rslow         SLOW 0  1G TC=0,0
V_V1         N16841879 0 1.27
E_SLOWtst         N16819994 0 VALUE { IF(V(FABY5) > 0.5, V(FSW)/5, V(FSW))    }
C_Cfa         N16789125 0  1n IC=0 TC=0,0
R_Rfa         FA_SD_INT N16789125  43.29k TC=0,0
E_pulsgen         N16828837 0 VALUE { IF(V(VCO_SQ) > 1u, 1, 0)    }
X_U5         13 5 d_d1
V_V2         N16841909 0 0.62
E_VCO_SIN         VCO_SQ 0 VALUE { SIN(2*3.142*V(N16819994)*TIME)    }
G_ABMII2         0P1V SAWTOOTH VALUE { IF(V(CLK) < 1  & V(FSW) > 1u,
+  I(V_IFA)/(V(FA)+2210*I(V_IFA)), (V(0P1V)-V(SAWTOOTH))/100)    }
E_ABM6         FSW 0 VALUE { IF(V(FA_SD_INT) > 0.5, 0,
+  ((4.503E11*I(V_IFA))/(1-1k*I(V_IFA)))**0.79365 )    }
C_Cshut_dly         5 0  150nF  TC=0,0
R_Rsaw2G         SAWTOOTH 0  10G TC=0,0
X_U10         SLOW CLK FABY5 N16834021 srlatchrhp_basic_gen PARAMS: VDD=1 VSS=0
+  VTHRESH=0.5
R_Rrmp2G         RAMP 0  10G TC=0,0
R_Rshut_dly         3 5  1 TC=0,0
V_p1V         0P1V 0
+PULSE 0 0.1 0 0 0
R_Rshut         VS 13  100k TC=0,0
X_U788         N16828837 N16832334 rising_oneshot PARAMS:  PULSE=155n VDD=1
+  VSS=0 VTHRESH=0.5
E_Eshut_dly         3 0 VALUE { IF(I(V_IFA) > 100u/65, 0, 1)    }
R_Rshut2g         SHUT 0  10G TC=0,0
.ENDS OSCR
*$
.SUBCKT PWM PWM_CLK RESET SET
V_V2         N167973070 0 1
X_U138         TONMIN N16795506 INV_BASIC_GEN PARAMS: VDD=1 VSS=0
+  VTHRESH=500E-3
E_ABM55         TONMIN 0 VALUE { IF(V(TON325N)>1,1,0)    }
G_ABMII5         0 TON325N VALUE { IF(V(PWM_CLK) > 0.5, 12.6u,0)    }
R_R5         0 TONMIN  1Meg TC=0,0
X_U139         TON325N N167973070 d_d
X_U17         PWM_CLK N16793497 SET N16793493 N16793552 N16793493
+  dffsbrb_rhpbasic_gen PARAMS: VDD=1 VSS=0 VTHRESH=500E-3
V_V1         N16793493 0 1
X_U137         RESET N16795506 N16793552 OR2_BASIC_GEN PARAMS: VDD=1 VSS=0
+  VTHRESH=500E-3
C_C1         TON325N 0  4p IC=0 TC=0,0
X_U1_S14    PWM_CLK 0 TON325N 0 PWM_U1_S14
.ENDS PWM
*$
.subckt PWM_U1_S14 1 2 3 4
S_S14         3 4 1 2 _S14
RS_S14         1 2 1G
.MODEL         _S14 VSWITCH Roff=1e9 Ron=1 Voff=0.75 Von=0.25
.ends PWM_U1_S14
*$
.SUBCKT LMERR_AMP PLUS MINUS OUT
R1 PLUS 0 1G
R2 MINUS 0 1G
R3 4 0 1G
D1 11 OUT _LMERR
.MODEL _LMERR D BV=1
V2 11 0 DC = 1.3
GB7 0 OUT VALUE {25E-6*V(9)}
EB9 3 0 VALUE {V(1)}
GB3 0 4 VALUE {1000*(V(PLUS,MINUS)-V(2))}
R5 3 9 1K
R7 0 2 10K
R8 2 1 300K
C4 4 0 10U
EB4 5 0 VALUE {V(4)}
R9 5 1 1
C5 1 0 .02U
D2 9 10 _D2_MOD
.MODEL _D2_MOD D BV=9
R10 OUT 0 48K
V5 10 0 DC = 5
.ENDS LMERR_AMP
*$
.MODEL DZ7P2 D  (IS=10F BV=7.2 IBV=10uA rs=0 n=1.00000 vj=1.00000 m=0.5)
*$
.model MPdrvr   PMOS (KP=2 RD=1 VTO=-2)
*$
.model MNdrvr   NMOS (KP=2 RD=1 VTO=2)
*$
.MODEL DMBRS340T3 d
+IS=0.000182183 RS=0.0312608 N=1.40283 EG=0.576586
+XTI=0.000499955 BV=1000 IBV=0.0001 CJO=4.92728e-10
+VJ=0.573693 M=0.464284 FC=0.5 TT=1e-09
+KF=0 AF=1
*$
.SUBCKT  FDS6690A  20  10  30
Rg     10    1    1
M1      2    1    3    3    DMOS    L=1u   W=1u
.MODEL DMOS NMOS (VTO={2*{-0.00384*TEMP+1.096}}  KP={-0.05*TEMP+58}
+  THETA=0.096 VMAX=4E5  LEVEL=3)
Cgs     1    3    1500p
Rd     20    4    3m TC=0.00376
Dds     3    4    DDS
.MODEL     DDS    D(BV={30*{0.00088*TEMP+0.978}}   M=0.3  CJO=800p   VJ=0.8)
Dbody   3   20    DBODY
.MODEL   DBODY    D(IS=1.4E-13   N=1   RS=40m   TT=100n)
Ra      4    2    3m TC=0.00376
Rs      3    5    0.5m
Ls      5    30   0.5n
M2      1    8    6    6   INTER
E2      8    6    4    1   2
.MODEL   INTER    NMOS(VTO=0  KP=10   LEVEL=1)
Cgdmax  7    4    1050p
Rcgd    7    4    10meg
Dgd     6    4    DGD
Rdgd    4    6    10meg
.MODEL     DGD    D(M=0.5   CJO=1050p   VJ=0.4)
M3      7    9    1    1   INTER
E3      9    1    4    1   -2
.ENDS FDS6690A
*$
.SUBCKT COMPHYS_BASIC_GEN INP INM HYS OUT PARAMS: VDD=1 VSS=0 VTHRESH=0.5
EIN INP1 INM1 INP INM 1
EHYS INP1 INP2 VALUE { IF( V(1) > {VTHRESH},-V(HYS),0) }
EOUT OUT 0 VALUE { IF( V(INP2)>V(INM1), {VDD} ,{VSS}) }
R1 OUT 1 1
C1 1 0 5n
RINP1 INP1 0 1K
.ENDS COMPHYS_BASIC_GEN
*$
.SUBCKT AND2_BASIC_GEN A B Y PARAMS: VDD=1 VSS=0 VTHRESH=0.5
E_ABMGATE    YINT 0 VALUE {{IF(V(A) > {VTHRESH}  &
+ V(B) > {VTHRESH},{VDD},{VSS})}}
RINT YINT Y 1
CINT Y 0 1n
.ENDS AND2_BASIC_GEN
*$
.SUBCKT AND3_BASIC_GEN A B C Y PARAMS: VDD=1 VSS=0 VTHRESH=0.5
E_ABMGATE    YINT 0 VALUE {{IF(V(A) > {VTHRESH}  &
+ V(B) > {VTHRESH} &
+ V(C) > {VTHRESH},{VDD},{VSS})}}
RINT YINT Y 1
CINT Y 0 1n
.ENDS AND3_BASIC_GEN
*$
.SUBCKT OR2_BASIC_GEN A B Y PARAMS: VDD=1 VSS=0 VTHRESH=0.5
E_ABMGATE    YINT 0 VALUE {{IF(V(A) > {VTHRESH}  |
+ V(B) > {VTHRESH},{VDD},{VSS})}}
RINT YINT Y 1
CINT Y 0 1n
.ENDS OR2_BASIC_GEN
*$
.SUBCKT INV_BASIC_GEN A  Y PARAMS: VDD=1 VSS=0 VTHRESH=0.5
E_ABMGATE    YINT 0 VALUE {{IF(V(A) > {VTHRESH} ,
+ {VSS},{VDD})}}
RINT YINT Y 1
CINT Y 0 1n
.ENDS INV_BASIC_GEN
*$
.SUBCKT BUF_DELAY_BASIC_GEN A  Y PARAMS: VDD=1 VSS=0 VTHRESH=0.5 DELAY = 10n
E_ABMGATE1    YINT1 0 VALUE {{IF(V(A) > {VTHRESH} ,
+ {VDD},{VSS})}}
RINT YINT1 YINT2 1
CINT YINT2 0 {DELAY*1.3}
E_ABMGATE2    YINT3 0 VALUE {{IF(V(YINT2) > {VTHRESH} ,
+ {VDD},{VSS})}}
RINT2 YINT3 Y 1
CINT2 Y 0 1n
.ENDS BUF_DELAY_BASIC_GEN
*$
.SUBCKT DFFSBRB_RHPBASIC_GEN Q QB CLK D RB SB PARAMS: VDD=1 VSS=0 VTHRESH=0.5
X1 CLK CLKdel INV_DELAY_BASIC_GEN PARAMS: VDD={VDD} VSS={VSS} VTHRESH={VTHRESH} DELAY = 15n
X2 CLK CLKdel CLKint AND2_BASIC_GEN PARAMS: VDD={VDD} VSS={VSS} VTHRESH={VTHRESH}
GQ 0 Qint VALUE = {IF(V(RB) < {VTHRESH},-5,IF(V(SB)< {VTHRESH},5, IF(V(CLKint)> {VTHRESH},
+ IF(V(D)> {VTHRESH},5,-5),0)))}
CQint Qint 0 1n
RQint Qint 0 1000MEG
D_D10 Qint MY5 D_D1
V1 MY5 0 5
D_D11 0 Qint D_D1
EQ Qqq 0 Qint 0 1
X3 Qqq Qqqd1 BUF_DELAY_BASIC_GEN PARAMS: VDD={VDD} VSS={VSS} VTHRESH={VTHRESH} DELAY = 20n
RQq Qqqd1 Q 1
EQb Qbr 0 VALUE = {IF( V(Q) > {VTHRESH}, {VSS},{VDD})}
RQb Qbr Qb 1
Cdummy1 Q 0 1nF
Cdummy2 QB 0 1nF
.MODEL D_D1 D( IS=1e-15 TT=10p Rs=0.05 N=.1  )
.IC V(Qint) {VSS}
.ENDS DFFSBRB_RHPBASIC_GEN
*$
.subckt d_d 1 2
d1 1 2 dd
.model dd D (Is = 1e-14 Rs = 0.1 N = 0.1 TT = 10p)
.ends d_d
*$
.SUBCKT INV_DELAY_BASIC_GEN A  Y PARAMS: VDD=1 VSS=0 VTHRESH=0.5 DELAY = 10n
E_ABMGATE1    YINT1 0 VALUE {{IF(V(A) > {VTHRESH} ,
+ {VDD},{VSS})}}
RINT YINT1 YINT2 1
CINT YINT2 0 {DELAY*1.3}
E_ABMGATE2    YINT3 0 VALUE {{IF(V(YINT2) > {VTHRESH} ,
+ {VSS},{VDD})}}
RINT2 YINT3 Y 1
CINT2 Y 0 1n
.ENDS INV_DELAY_BASIC_GEN
*$
.SUBCKT BUF_BASIC_GEN A  Y PARAMS: VDD=1 VSS=0 VTHRESH=0.5
E_ABMGATE    YINT 0 VALUE {{IF(V(A) > {VTHRESH} ,
+ {VDD},{VSS})}}
RINT YINT Y 1
CINT Y 0 1n
.ENDS BUF_BASIC_GEN
*$
.SUBCKT D_D1 1 2
D1 1 2 DD1
.MODEL DD1 D ( IS=1e-15 TT=10p Rs=0.05 N=.1 )
.ENDS D_D1
*$
.SUBCKT CESR IN OUT
+ PARAMs:  C=100u ESR=0.01 X=2 IC=0
C               IN 1  {C*X} IC={IC}
RESR            1 OUT {ESR/X}
.ENDS CESR
*$
.SUBCKT LDCR IN OUT
+ PARAMs:  L=1u DCR=0.01 IC=0
L               IN 1  {L} IC={IC}
RDCR            1 OUT {DCR}
.ENDS LDCR
*$
.SUBCKT SRLATCHRHP_BASIC_GEN S R Q QB PARAMS: VDD=1 VSS=0 VTHRESH=0.5
GQ 0 Qint VALUE = {IF(V(R) > {VTHRESH},-5,IF(V(S)>{VTHRESH},5, 0))}
CQint Qint 0 1n
RQint Qint 0 1000MEG
D_D10 Qint MY5 D_D1
V1 MY5 0 {VDD}
D_D11 MYVSS Qint D_D1
V2 MYVSS 0 {VSS}
EQ Qqq 0 Qint 0 1
X3 Qqq Qqqd1 BUF_BASIC_GEN PARAMS: VDD={VDD} VSS={VSS} VTHRESH={VTHRESH}
RQq Qqqd1 Q 1
EQb Qbr 0 VALUE = {IF( V(Q) > {VTHRESH}, {VSS},{VDD})}
RQb Qbr QB 1
Cdummy1 Q 0 1n
Cdummy2 QB 0 1n
.IC V(Qint) {VSS}
.MODEL D_D1 D ( IS=1e-15 TT=10p Rs=0.05 N=.1 )
.ENDS SRLATCHRHP_BASIC_GEN
*$
.SUBCKT RISING_ONESHOT IN OUT PARAMS: PULSE=100n VDD=1 VSS=0 VTHRESH=0.5
D_D1         INT IN DD
C_C1         0 INT  1n
X_U22         INT IN_B_DELAYED INV_BASIC_GEN PARAMS: VDD={VDD} VSS={VSS}
+  VTHRESH={VTHRESH}
R_R1         IN INT  {PULSE/(0.693 * 1E-9)}
X_U1         IN IN_B_DELAYED OUT AND2_BASIC_GEN PARAMS: VDD={VDD} VSS={VSS}
+  VTHRESH={VTHRESH}
.MODEL DD D( IS=1F N=0.01 TT = 10p )
.ENDS RISING_ONESHOT
.SUBCKT csd17553q5a  1 2 3
* PARAMETER (local) DEFINITIONS SECTION
 .PARAM  ptrc1    9.75e-3
 .PARAM  ptrc2    25.0e-6
 .PARAM  pwidthP  3.9199333333
 .PARAM  pwidth   {pwidthP*1e6}
 .PARAM  perimP   {2.1*pwidthP}
 .PARAM  perim    {perimP*1e6}
****** MODEL SUBCIRCUIT BEGINS HERE     ******************************
M1   10 11 12 12  NMOS          W={pwidthP} L=0.5u  PS={perimP} PD={perimP}
DBD   8  7       DBD
CBD0  8  7   3e-12
RBD0  8  7   1e10
*CGD0  5  7      100E-12
CGS0  5  8       0.5e-12
M2   12 11 12 20  PMOSd W={pwidthP} L=0.1u PS={perimP} PD={perimP}
DDx  20  10  DDx
DDG1  10        101             DD1
DDG2  5         101             DD1
*DDG3  102      103             DD1
*DDG4  103      104             DD1
*DDG5  104      105             DD1
*DDG6  105      106             DD1
*DDG7  106      107             DD1
*DDG8  5        107             DD1
* Note:  gate oxide capacitance included in NMOS below
CGS   5 13       377E-12
RGS  13  8       35
LGG   2  5       2.1e-9
RGG   5 11       1.8
RSB  12  9       RTEMP 0.05e-3
RSS   9  8       RTEMP 0.15e-3
RSP   8  6       0.45e-3
LSS   6  3       0.47e-9
RSL   6  3   0.5
RDD   7 10       RTEMP 0.90e-3
RDP   4  7       0.90e-3
LDD   1  4       0.05e-9
*******************************************************************
.MODEL  NMOS   NMOS (
* CONTROL PARAMETERS
+ LEVEL  = 7             VERSION = 3.2         CAPMOD = 2
* DC PARAMETERS
+ NLX    = 1.74E-7       VBM    = -5           DVT0   = 2.2
+ DVT1   = 0.53          DVT2   = -0.032       U0     = 650
+ UA     = 1.4e-9        UB     = 2.4e-18      A0     = 1.10
+ AGS    = 0.0           A1     = 0.0          A2     = 1.0
+ LINT   = 0.055e-6      VOFF   = -0.24        NFACTOR= 1.7
+ ETA0   = 0.005         ETAB   = -0.07        DSUB   = 1.4
+ PCLM   = 1.30          PDIBLC1= 0.02         PDIBLC2= 0.004
+ DROUT  = 0.90          PSCBE1 = 3.0e8        PSCBE2 = 1e-6
+ PVAG   = 0.1           DELTA  = 0.0220       JS     = 0
* AC AND CAPACITANCE PARAMETERS
+ CGSO   = 212.50e-12                           CGDO   = 1e-18        CGBO   = 1e-18
+ CJ     = 1e-18         CJSW   = 1e-18        CF     = 0
* TEMPERATURE PARAMETERS
+ TNOM   = 25            UTE    = -1.5         KT1    = -0.85
+ KT1L   = 1.0e-15       KT2    = 0.022        UA1    = 1.75e-9
+ UB1    = -0.8e-18
* PROCESS PARAMETERS
+ TOX    = 3.00e-8       XJ     = 3e-7          NCH    = 1.35e17
+ NSUB   = 1.0e16)
*******************************************************************
.MODEL  PMOSd   PMOS (   LEVEL  = 1
+ TNOM   = 25            VTO    = -1.0          IS     = 6.0e-14
+ TOX    = 3.0e-8        NSUB   = 2.0e17                        GAMMA  = 15
+ CJ     = 1e-18         CJSW   = 1e-18
+ CGSO   = 1e-18         CGDO   = 1e-18         CGBO   = 0  )
*******************************************************************
.MODEL DBD D (CJO=3500e-12 VJ=1.0 M=0.625 TNOM=25
+ FC=0.5 TT=2e-09 XTI=3.3 BV=31
+ IS=9.0e-12 N=1.045 RS=0.50e-3 TRS1=4.0e-3)
.MODEL DD1  D (CJO=0.90e-09 VJ=0.8 M=0.9 IS=1e-13 RS=0.1 TNOM=25)
.MODEL DD2  D (CJO=4.00e-10 VJ=0.90 M=0.9 IS=1e-13 RS=0.1 TNOM=25)
.MODEL DDx D (CJO=0.0001e-09 VJ=0.9 M=0.9 IS=1e-13 RS=1.0 TNOM=25)
*******************************************************************
.MODEL RTEMP RES (TC1={ptrc1} TC2={ptrc2})
*******************************************************************
.ENDS csd17553q5a
.lib LM3478_TRANS.lib
.inc CSD17553Q5A.lib
* Transformer represented by two coupled inductors
* Not exact diode but similar specs for simulation
* Acceptable voltages:
* 2.97-40V
.lib C:\Users\jcmul\OneDrive\Documents\Engineering Classes\ENGR 460\460LTSpice\LM3478_TRANS.lib
.backanno
.end